# Altium schematic sheet MuscleVolt Schematic.SchDoc
size C; Organization: Altium Limited; Address1: L3, 12a Rodborough Rd; Address2: Frenchs Forest; Address3: NSW; Address4: Australia 2086
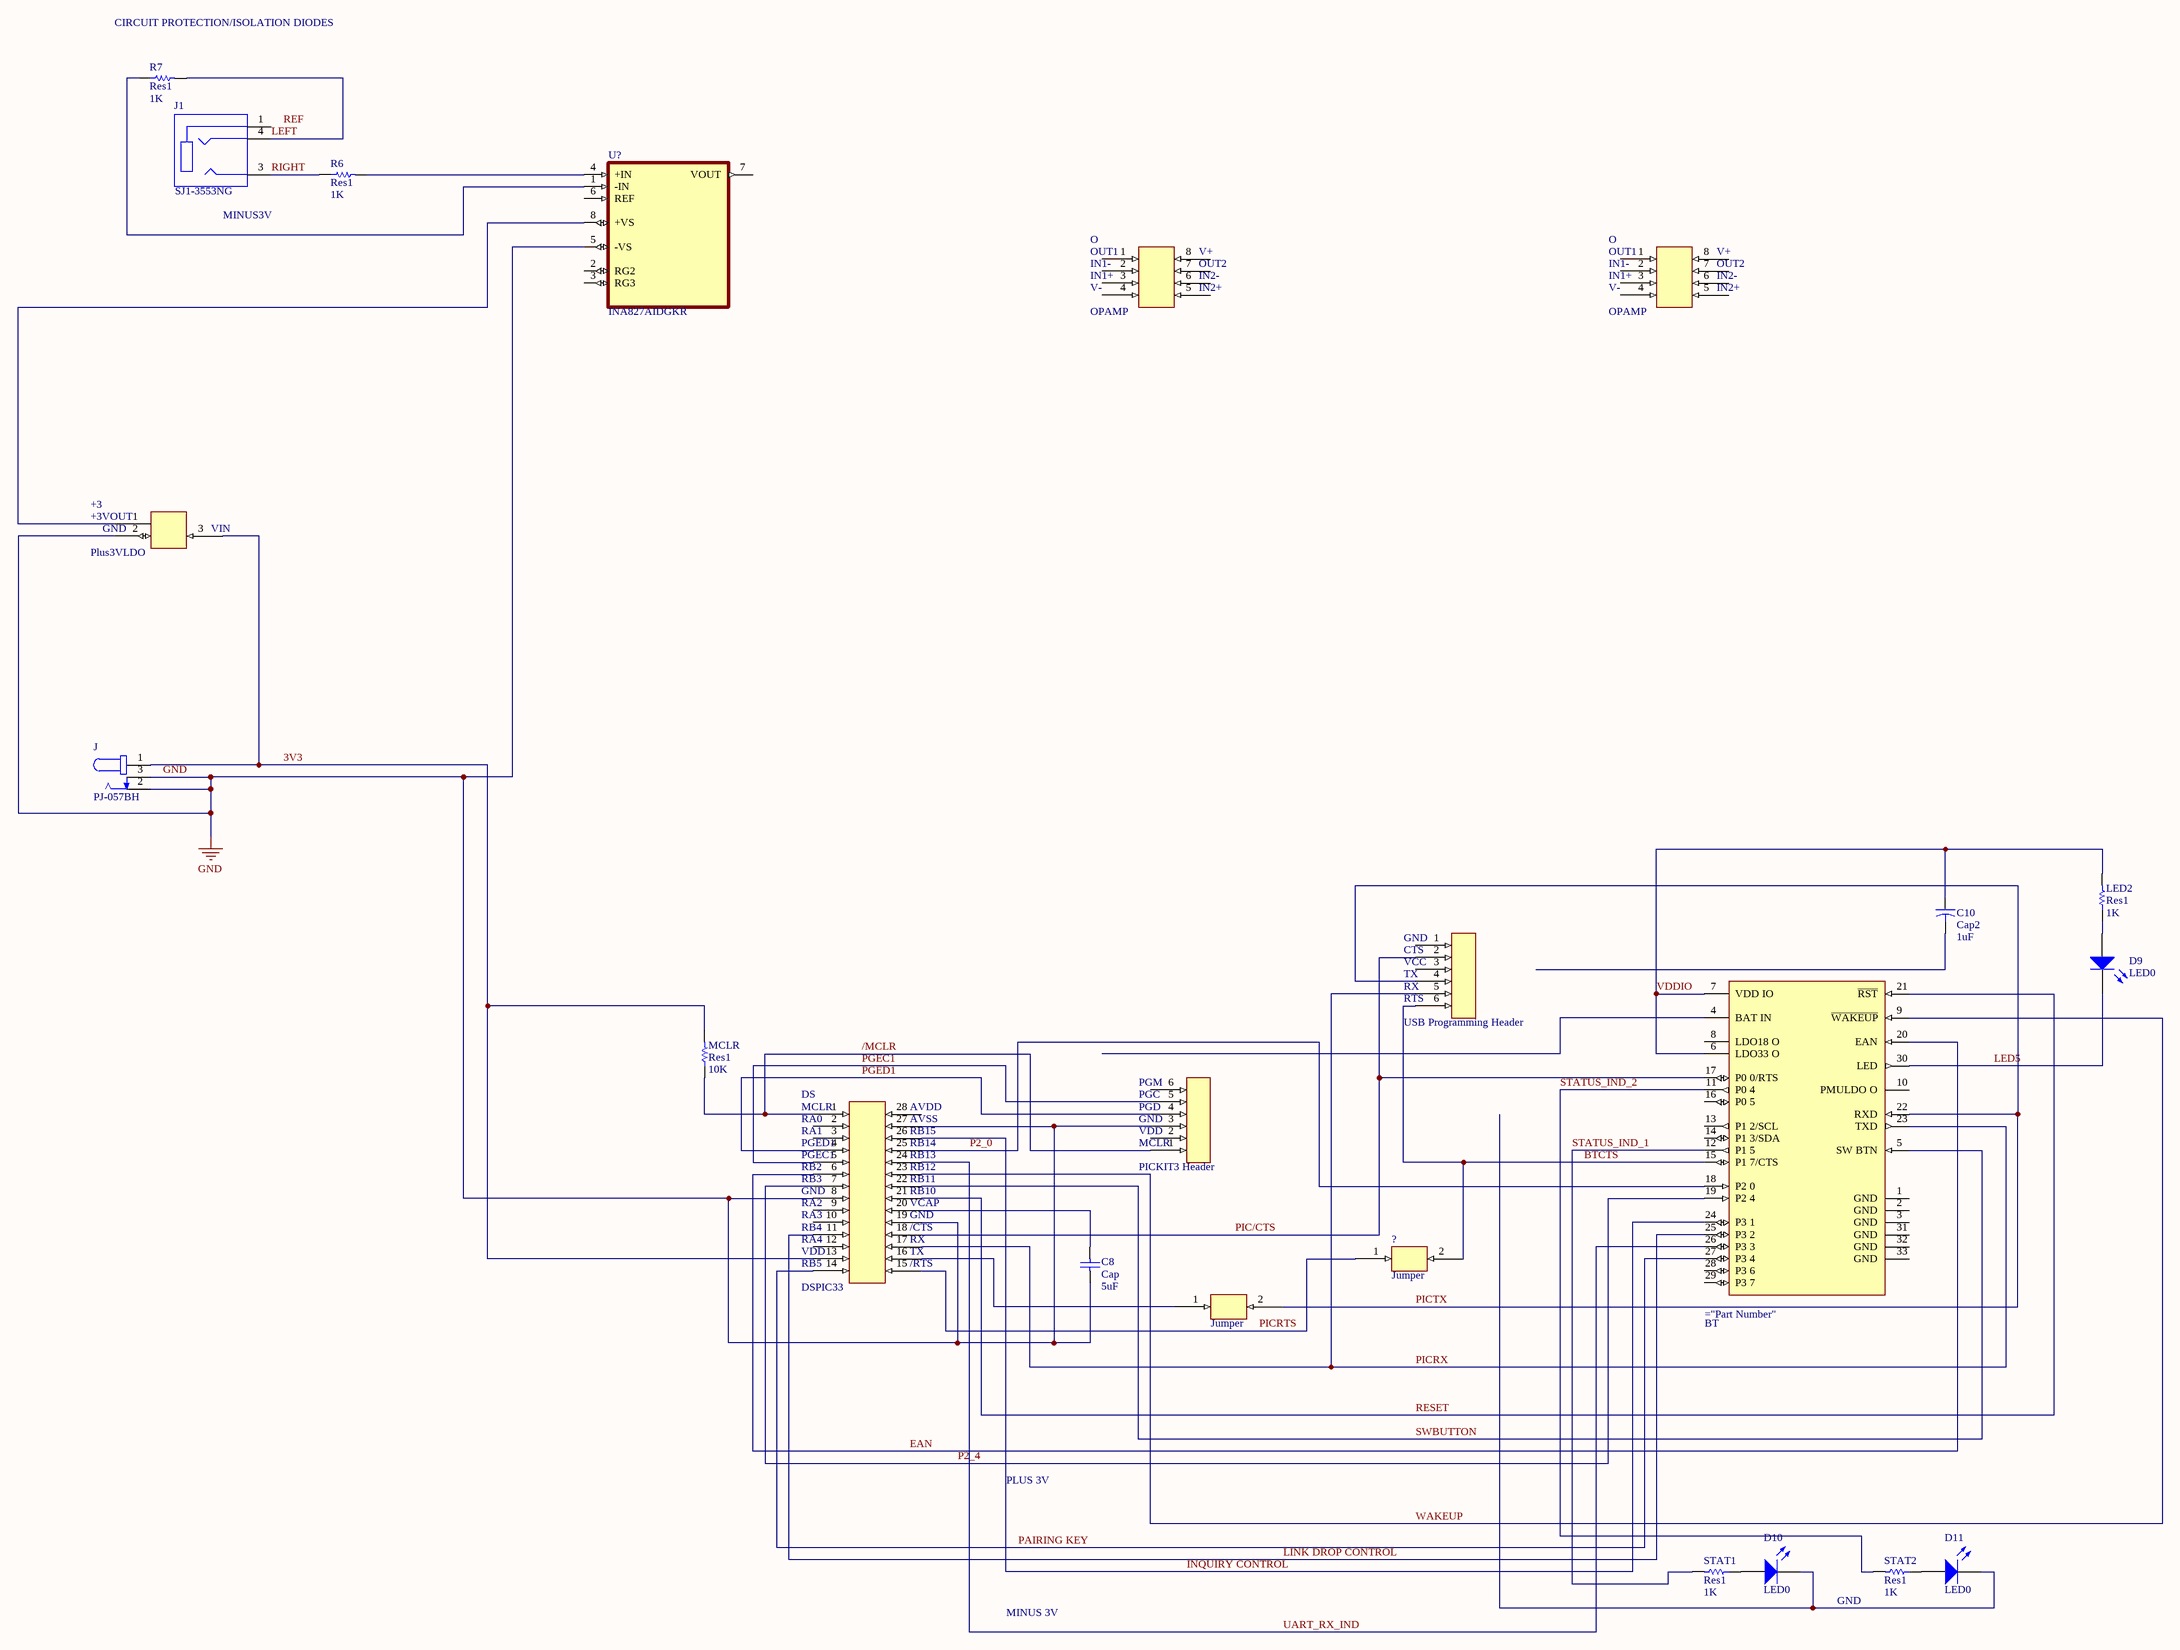
[diagram p0: MuscleVolt Schematic.SchDoc]

## Parts
(Parts that share a designator on the sheet are numbered #1, #2 ... from top to bottom, then left to right.)
+3  Plus3VLDO  [Plus3VLDO]
?#1  USB Programming Header  [6 Pin Header]
?#2  PICKIT3 Header  [6 Pin Header]
?#3  Jumper  [JUMPER]
?#4  Jumper  [JUMPER]
BT  BM78SPPS5MC2-0002AA  [Microchip_BM78SPPS5MC2-0002AA_MFG]  (value not drawn)
C8  Cap  value 5uF  [RAD-0.3]
C10  Cap2  value 1uF  [CAPR5-4X5]
D9  LED0  [LED-0]
D10  LED0  [LED-0]
D11  LED0  [LED-0]
DS  DSPIC33  [DSPIC33]
J  PJ-057BH  [CUI_PJ-057BH]
J1  SJ1-3553NG  [AUDIO JACK II]
LED2  Res1  value 1K  [AXIAL-0.3]
MCLR  Res1  value 10K  [AXIAL-0.3]
O#1  OPAMP  [8-PIN POINT3 DIP - duplicate]
O#2  OPAMP  [8-PIN POINT3 DIP - duplicate]
R6  Res1  value 1K  [AXIAL-0.3]
R7  Res1  value 1K  [AXIAL-0.3]
STAT1  Res1  value 1K  [AXIAL-0.3]
STAT2  Res1  value 1K  [AXIAL-0.3]
U?  INA827AIDGKR  [SOP65P490X110-8N]

## Nets
GND: +3.2 ?#2.3 C8.1 DS.8 DS.19 DS.27 J.2 J.3 U?.5(-VS)
3V3: +3.3 DS.13 J.1 MCLR.2
/MCLR: ?#2.1 DS.1 MCLR.1
BTCTS: ?#1.6 ?#3.2 BT.15(P1_7/CTS)
EAN: BT.20(EAN) DS.6
INQUIRY CONTROL: BT.24(P3_1) DS.26
LED5: BT.30(LED) D9.2(K)
LEFT: J1.4 R7.2
LINK DROP CONTROL: BT.25(P3_2) DS.11
P2_0: BT.18(P2_0) DS.25
P2_4: BT.19(P2_4) DS.7
PAIRING KEY: BT.27(P3_4) DS.14
PGEC1: ?#2.5 DS.5
PGED1: ?#2.4 DS.4
PIC/CTS: ?#1.2 BT.17(P0_0/RTS) DS.18
PICRTS: ?#3.1 DS.15
PICRX: ?#1.5 BT.23(TXD) DS.17
PICTX: ?#1.4 ?#4.2 BT.22(RXD)
RESET: BT.21(~{RST}) DS.21
RIGHT: J1.3 R6.1
STATUS_IND_1: BT.12(P1_5) STAT1.2
STATUS_IND_2: BT.11(P0_4) STAT2.2
SWBUTTON: BT.5(SW_BTN) DS.22
UART_RX_IND: BT.26(P3_3) DS.24
VDDIO: BT.6(LDO33_O) BT.7(VDD_IO) C10.1 LED2.2
WAKEUP: BT.9(~{WAKEUP}) DS.23
Net+3_1: +3.1 U?.8(+VS)
Net?#4_1: ?#4.1 DS.16
NetC8_2: C8.2 DS.20
NetD9_1: D9.1(A) LED2.1
NetD10_1: D10.1(A) STAT1.1
NetD10_2: D10.2(K) D11.2(K)
NetD11_1: D11.1(A) STAT2.1
NetR6_2: R6.2 U?.4(+IN)
NetR7_1: R7.1 U?.1(-IN)

Not connected (* = marked no-connect by the designer): ?#1 1 3; ?#2 2 6; BT 1(GND) 2(GND) 3(GND) 4(BAT_IN) 8(LDO18_O) 10(PMULDO_O) 13(P1_2/SCL) 14(P1_3/SDA) 16(P0_5) 28(P3_6) 29(P3_7) 31(GND) 32(GND) 33(GND); C10 2; DS 2 3 9 10 12 28; J1 1; O#1 1 2 3 4 5 6 7 8; O#2 1 2 3 4 5 6 7 8; U? 2(RG2) 3(RG3) 6(REF) 7(VOUT)

## Notes on the sheet
- CIRCUIT PROTECTION/ISOLATION DIODES
- (near J1) MINUS3V
- PLUS 3V
- MINUS 3V
- (near STAT2) GND
- Labels drawn without touching a wire or pin: REF
- Title
- Size:
- Date:
- File:
- C
- Number:
- Time:
- Revision:
- Sheet
- of
- (in symbol DSPIC33) MCLR; AVDD; RA0; AVSS; RA1; RB15; PGED1; RB14; PGEC1; RB13; RB2; RB12; RB3; RB11; GND; RB10; RA2; VCAP; RA3; RB4; /CTS; RA4; RX; VDD; TX; RB5; /RTS
- (in symbol OPAMP) OUT1; V+; IN1-; OUT2; IN1+; IN2-; V-; IN2+
- (in symbol PICKIT3 Header) PGM; PGC; PGD; GND; VDD; MCLR
- (in symbol Plus3VLDO) +3VOUT; GND; VIN
- (in symbol USB Programming Header) GND; CTS; VCC; TX; RX; RTS

## Library data of the parts
C8 = Cap: Capacitor; Published: 8-Jun-2000; LatestRevisionDate: 17-Jul-2002; LatestRevisionNote: Re-released for DXP Platform.; PackageReference: RAD-0.3; Publisher: Altium Limited; PackageDescription: Radial Cap, Thru-Hole; 2 Leads; 0.3 in Pin Spacing
C10 = Cap2: Capacitor; Published: 23-Sep-2002; PackageReference: CAPR5-4X5; Publisher: Altium Limited; PackageDescription: Capacitor; 2 Leads
D9-D11 = LED0: Typical INFRARED GaAs LED; Published: 8-Jun-2000; LatestRevisionDate: 08-Jul-2005; LatestRevisionNote: Mech Layer 1 removed.; PackageReference: LED-0; Publisher: Altium Limited; PackageDescription: LED; 2 Leads
J = PJ-057BH: 2.5 x 6.3 mm, 5.0 A, Horizontal, Through Hole, Pick-n-Place Top, Dc Power Jack Connector; MF: CUI Devices; Package: None; Value: *; Price: None; MP: PJ-057BH; SnapEDA_Link: https://www.snapeda.com/parts/PJ-057BH/CUI%20Devices/view-part/590963/?ref=snap; Availability: Unavailable
J1 = SJ1-3553NG: SJ1 Series 3.5 mm 12 V Right Angle Through Hole Isolated Stereo Audio Jack; Package: None; Price: None; Value: *; MP: SJ1-3553NG; Availability: Unavailable
LED2 MCLR R6 R7 STAT1 STAT2 = Res1: Resistor; Published: 8-Jun-2000; LatestRevisionDate: 17-Jul-2002; LatestRevisionNote: Re-released for DXP Platform.; PackageReference: AXIAL-0.3; Publisher: Altium Limited; PackageDescription: Axial Device, Thru-Hole; 2 Leads; 0.3 in Pin Spacing
O#1 O#2 = OPAMP: LM358
U? = INA827AIDGKR: Precision, G>5, 200uA, 2.7-V to 36-V Supply Instrumentation Amplifier 8-VSSOP -40 to 125; MF: Texas Instruments; Value: *; Check_prices: https://www.snapeda.com/parts/INA827AIDGKR/Texas%20Instruments/view-part/122242/?ref=eda; Price: None; MP: INA827AIDGKR; SnapEDA_Link: https://www.snapeda.com/parts/INA827AIDGKR/Texas%20Instruments/view-part/122242/?ref=snap; Purchase-URL: https://pricing.snapeda.com/search/part/INA827AIDGKR/?ref=eda; Package: VSSOP-8 Texas Instruments; Availability: Good